# EAGLE design terminals (EAGLE 9.3.1)
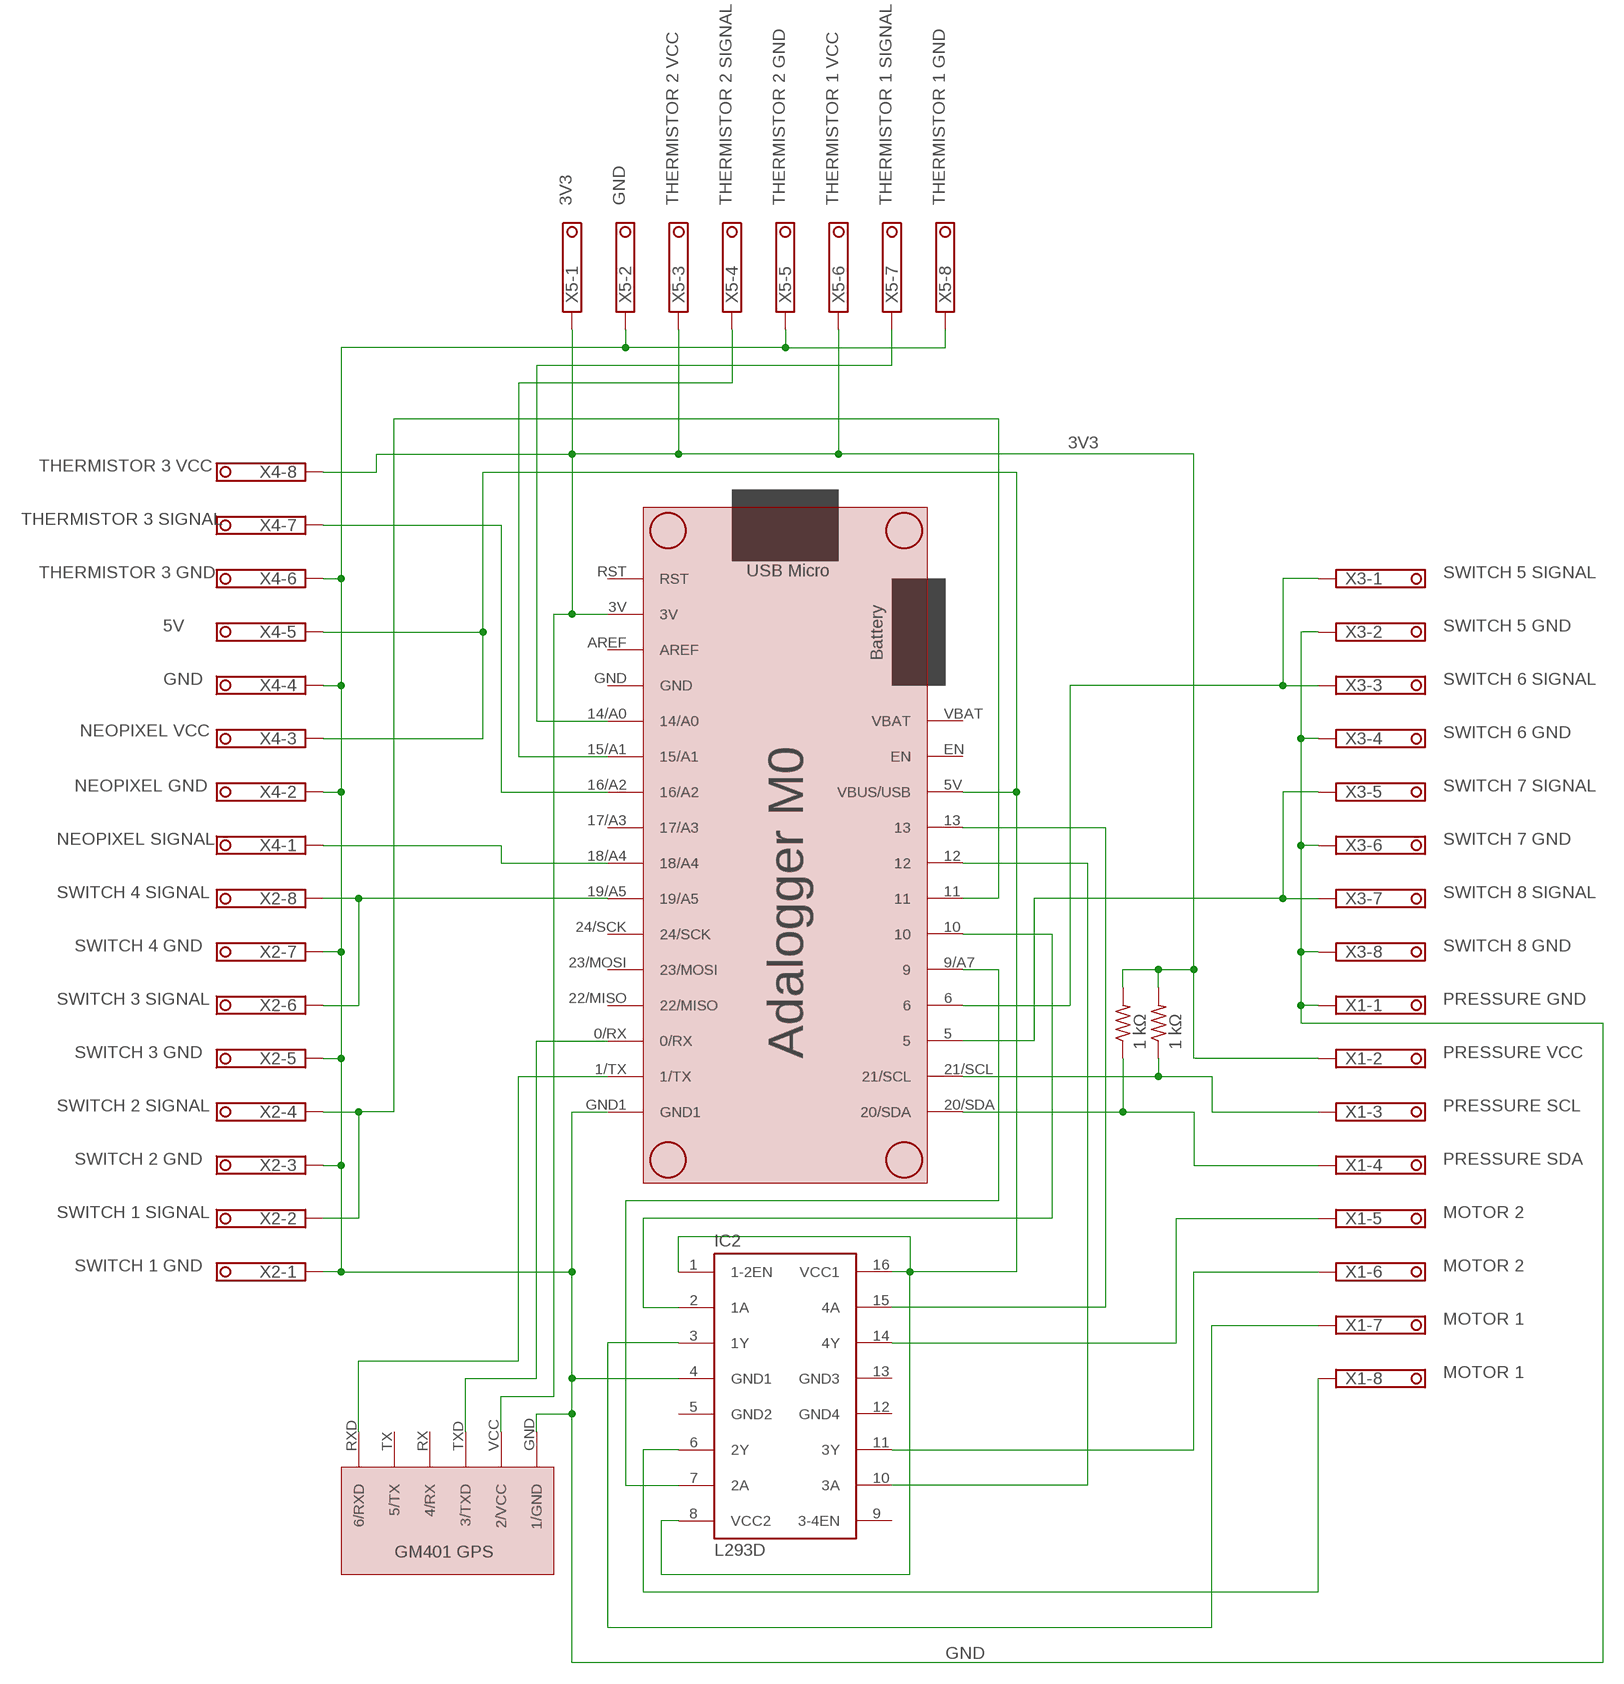
[diagram p0: schematic, sheet 1]

## Parts
IC2  L293D  [DIL16]
M0  Adalogger M0  ADALOGGER_M0  [BOARD]
R1  1 kΩ  R-US_0204/7  [0204/7]
R5  1 kΩ  R-US_0204/7  [0204/7]
U$1  GPS  [GPS_BREAKOUT]
X1  1751303  [1751303]
X2  1751303  [1751303]
X3  1751303  [1751303]
X4  1751303  [1751303]
X5  1751303  [1751303]

## Nets
3V3: M0.3V R1.2 R5.2 U$1.VCC(2/VCC) X1.2 X4.8 X5.1 X5.3 X5.6
5V: IC2.1(1-2EN) IC2.8(VCC2) IC2.16(VCC1) M0.5V(VBUS/USB) X4.3 X4.5
GND: IC2.4(GND1) M0.GND1 U$1.GND(1/GND) X1.1 X2.1 X2.3 X2.5 X2.7 X3.2 X3.4 X3.6 X3.8 X4.2 X4.4 X4.6 X5.2 X5.5 X5.8
GPS_RX: M0.1/TX U$1.RXD(6/RXD)
GPS_TX: M0.0/RX U$1.TXD(3/TXD)
L293_1A: IC2.2(1A) M0.10
L293_2A: IC2.7(2A) M0.9/A7
MOTOR_1_NEG: IC2.6(2Y) X1.8
MOTOR_1_POS: IC2.3(1Y) X1.7
MOTOR_2_NEG: IC2.11(3Y) X1.6
MOTOR_2_POS: IC2.14(4Y) X1.5
N$28: IC2.15(4A) M0.13
N$30: IC2.10(3A) M0.12
NEOPIXEL_SIG: M0.18/A4 X4.1
SCL: M0.21/SCL R5.1 X1.3
SDA: M0.20/SDA R1.1 X1.4
SW_1_2_SIG: M0.11 X2.2 X2.4
SW_3_4_SIG: M0.19/A5 X2.6 X2.8
SW_5_6_SIG: M0.6 X3.1 X3.3
SW_7_8_SIG: M0.5 X3.5 X3.7
THERM_1_SIG: M0.14/A0 X5.7
THERM_2_SIG: M0.15/A1 X5.4
THERM_3_SIG: M0.16/A2 X4.7
Unconnected: IC2.9(3-4EN) M0.17/A3 M0.22/MISO M0.23/MOSI M0.24/SCK M0.AREF M0.EN M0.GND M0.RST M0.VBAT U$1.RX(4/RX) U$1.TX(5/TX)

## Notes on the sheet
- 3V3 | GND | THERMISTOR 2 VCC | THERMISTOR 2 SIGNAL | THERMISTOR 2 GND | THERMISTOR 1 VCC | THERMISTOR 1 SIGNAL | THERMISTOR 1 GND
- 3V3
- THERMISTOR 3 VCC
- THERMISTOR 3 SIGNAL
- THERMISTOR 3 GND | SWITCH 5 SIGNAL
- 5V | SWITCH 5 GND
- GND | SWITCH 6 SIGNAL
- NEOPIXEL VCC | SWITCH 6 GND
- NEOPIXEL GND | SWITCH 7 SIGNAL
- NEOPIXEL SIGNAL | SWITCH 7 GND
- SWITCH 4 SIGNAL | SWITCH 8 SIGNAL
- SWITCH 4 GND | SWITCH 8 GND
- SWITCH 3 SIGNAL | PRESSURE GND
- SWITCH 3 GND | PRESSURE VCC
- SWITCH 2 SIGNAL | PRESSURE SCL
- SWITCH 2 GND | PRESSURE SDA
- SWITCH 1 SIGNAL | MOTOR 2
- SWITCH 1 GND | MOTOR 2
- MOTOR 1
- MOTOR 1
- GND

## Power pins joined to a net without a drawn wire
GND2: IC2.5(GND2)
GND3: IC2.13(GND3)
GND4: IC2.12(GND4)

## Library data of the parts
IC2 = st-microelectronics:L293D: PUSH-PULL 4 CHANNEL DRIVER; MPN: L293D; OC_FARNELL: 9589619; OC_NEWARK: 56P8249
M0 = Adalogger_32u4:ADALOGGER_M0
R1 R5 = adafruit:R-US_: RESISTOR, American symbol
U$1 = Adalogger_32u4:GPS
X1-X5 = con-phoenix-350:1751303: MKDS 1/ 8-3,5 Printklemme Nennstrom: 10 A Bemessungsspannung: 160 V Raster: 3,5 mm Polzahl: 8 Montageart: Löten Anschlussart: Schraubanschluss Anschlussrichtung vom Leiter zur Platine: 0° Source: http://eshop.phoenixcontact.com .. .pdf; OC_FARNELL: unknown; OC_NEWARK: unknown

## Board
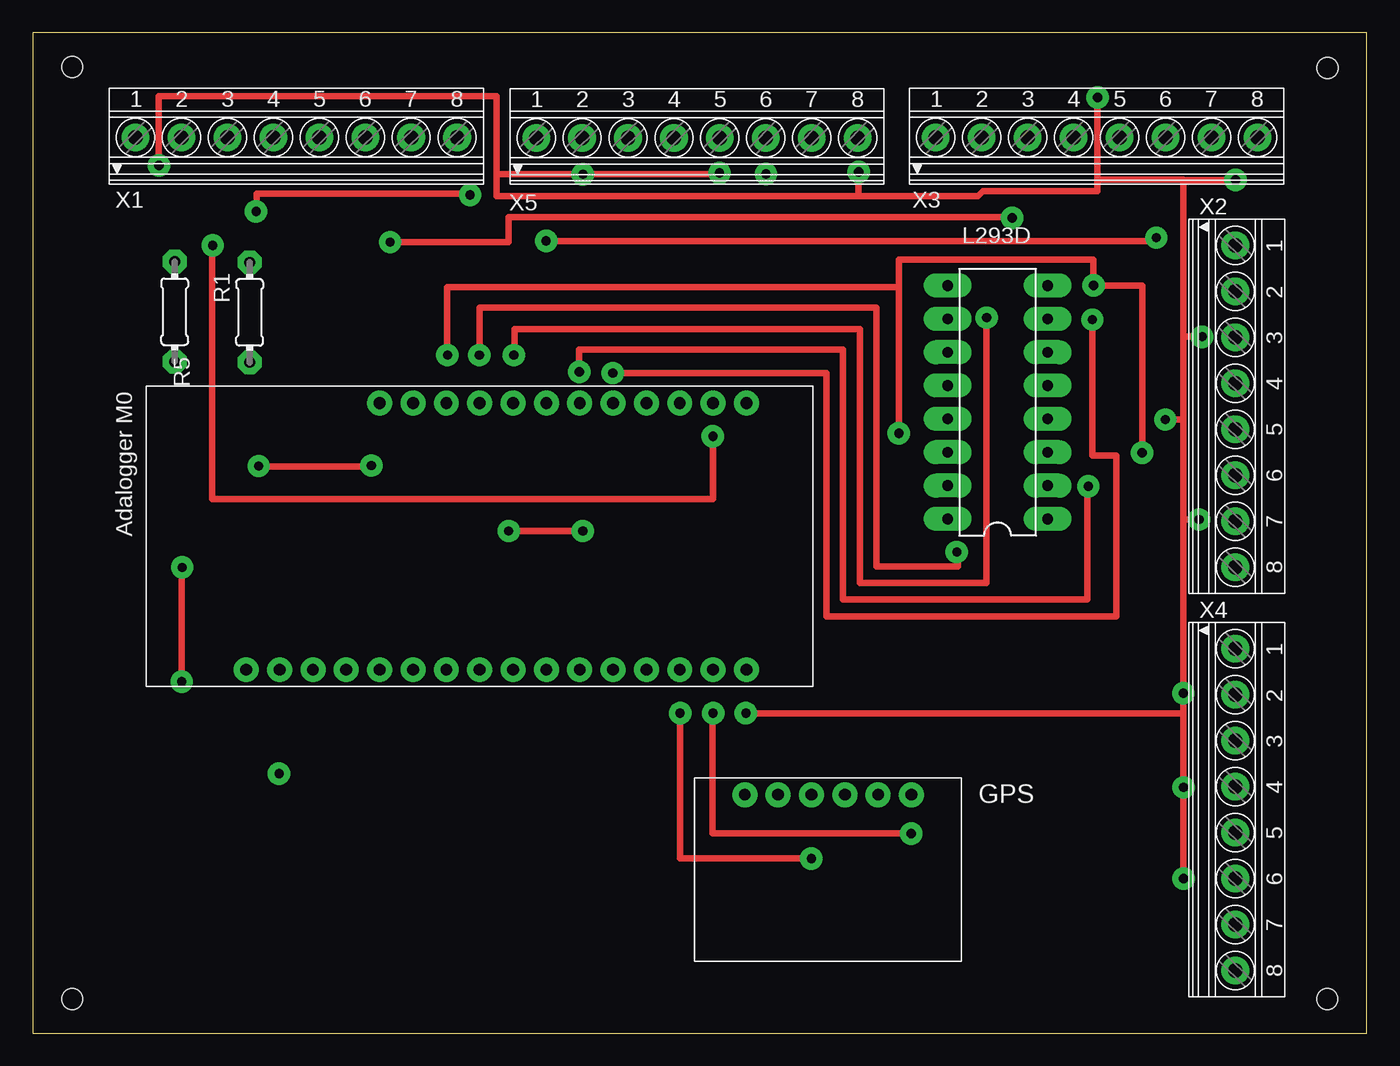
[diagram p1: board, top side]
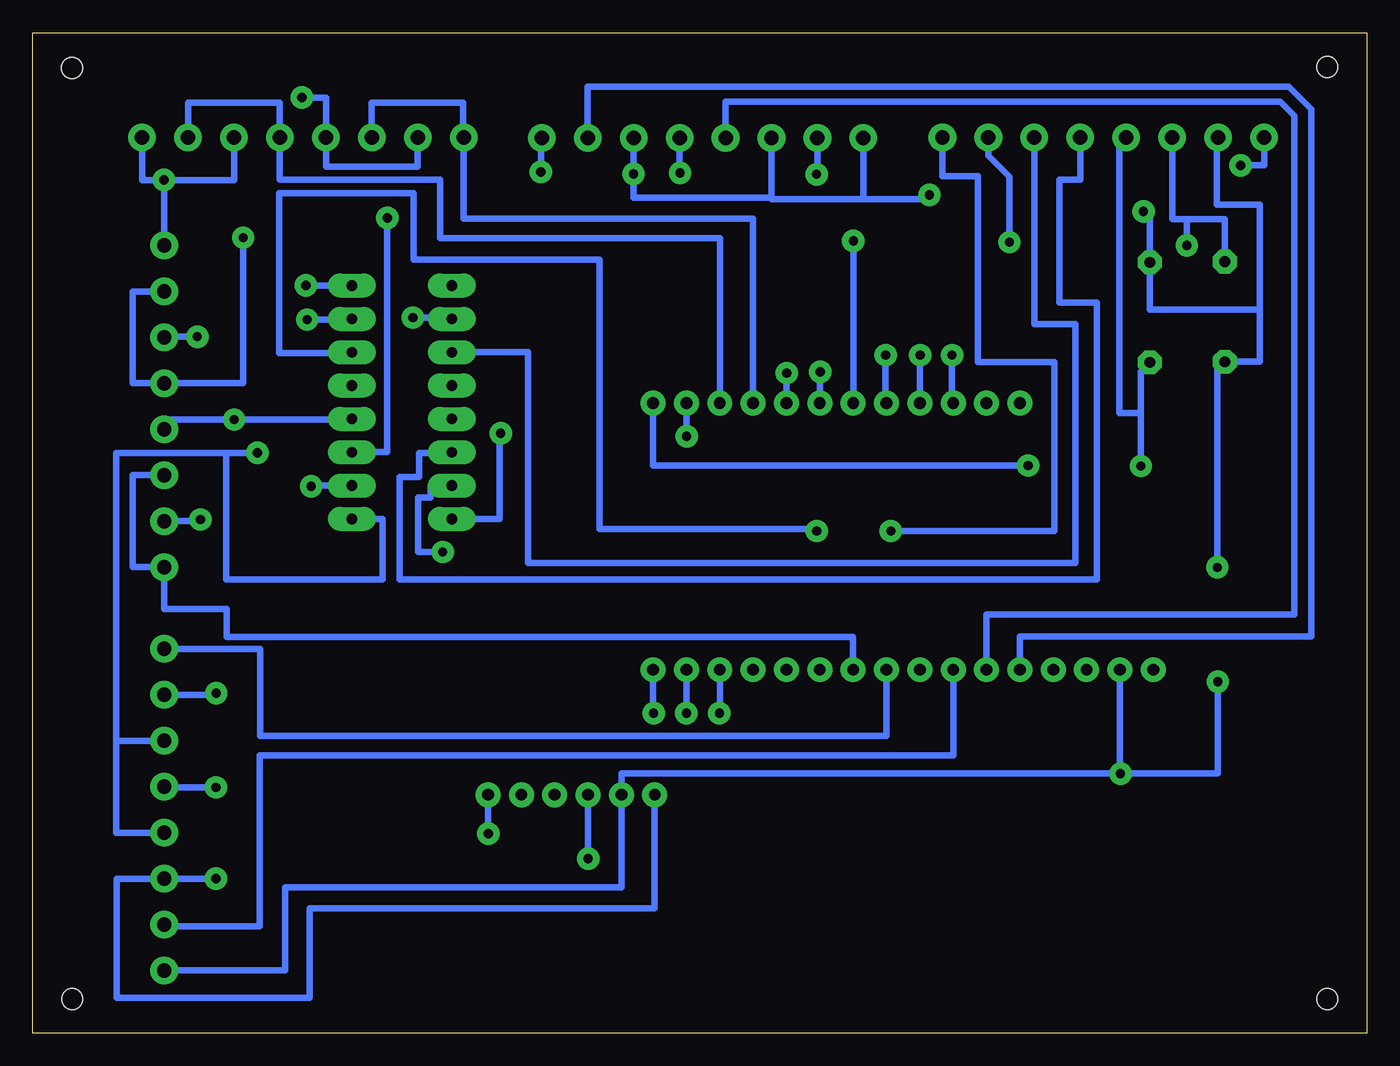
[diagram p2: board, bottom side, seen from below]

Size 101.6 x 76.2 mm. Coordinates in mm from the lower left corner, seen from the top.
Outline: 0,0 101.6,0 101.6,76.2 0,76.2 0,0
Copper layers (1*16): Top 0.035mm / dielectric 1.5mm / Bottom 0.035mm
Design rules "voltera-dru *": minimum track width 10mil, minimum drill 0.7mm, track to track 10mil, track to pad 10mil, pad to pad 0.6mm, via to via 0.6mm, smd to smd 0mil, copper to edge 0mil, drill to drill 0.8mm, minimum pad ring 0.5mm, minimum via ring 0.5mm, stop-mask expansion 4mil, vias tented up to drill 0mil, thermal gap 10mil
Holes 1.6 mm at 3,73.6 98.61,73.53 98.6,2.6 3,2.6

### Footprints (pad centres in the part's own frame; a part is rotated, then mirrored left to right if it is on the bottom)
DIL16 = drill 0.813 long: 1 -8.89,-3.81; 2 -6.35,-3.81; 3 -3.81,-3.81; 4 -1.27,-3.81; 5 1.27,-3.81; 6 3.81,-3.81; 7 6.35,-3.81; 8 8.89,-3.81; 9 8.89,3.81; 10 6.35,3.81; 11 3.81,3.81; 12 1.27,3.81; 13 -1.27,3.81; 14 -3.81,3.81; 15 -6.35,3.81; 16 -8.89,3.81
BOARD = drill 0.9 pad 1.7: 0/RX 1.27,-40.64; 1/TX 1.27,-43.18; 3V 1.27,-10.16; 5 21.59,-40.64; 5V 21.59,-22.86; 6 21.59,-38.1; 9/A7 21.59,-35.56; 10 21.59,-33.02; 11 21.59,-30.48; 12 21.59,-27.94; 13 21.59,-25.4; 14/A0 1.27,-17.78; 15/A1 1.27,-20.32; 16/A2 1.27,-22.86; 17/A3 1.27,-25.4; 18/A4 1.27,-27.94; 19/A5 1.27,-30.48; 20/SDA 21.59,-45.72; 21/SCL 21.59,-43.18; 22/MISO 1.27,-38.1; 23/MOSI 1.27,-35.56; 24/SCK 1.27,-33.02; AREF 1.27,-12.7; EN 21.59,-20.32; GND 1.27,-15.24; GND1 1.27,-45.72; RST 1.27,-7.62; VBAT 21.59,-17.78
0204/7 = drill 0.813 pad 1.676 octagon: 1 -3.81,0; 2 3.81,0
GPS_BREAKOUT = drill 0.9 pad 1.27: GND 3.81,-1.27; RX 11.43,-1.27; RXD 16.51,-1.27; TX 13.97,-1.27; TXD 8.89,-1.27; VCC 6.35,-1.27
1751303 = drill 1.1 pad 1.7: 1 -12.25,-0.1; 2 -8.75,-0.1; 3 -5.25,-0.1; 4 -1.75,-0.1; 5 1.75,-0.1; 6 5.25,-0.1; 7 8.75,-0.1; 8 12.25,-0.1

### Placement (x,y rotation side)
IC2  73.48,48.06 90 top
M0  8.64,26.42 90 top
R1  16.51,54.9 90 top
R5  10.8,54.95 270 top
U$1  50.42,19.43 0 top
X1  20.07,68.33 0 top
X2  91.69,47.75 270 top
X3  81.03,68.33 0 top
X4  91.69,17.02 270 top
X5  50.59,68.31 0 top

### Tracks (layer width: path | path; a pad name or v marks a point on that pad's centre or on a via)
3V3  (via drill 0.7)
  Top 0.5: v11.38,35.48 11.34,35.44 v11.34,26.77 | v17,62.6 17.03,62.63 17.03,63.93 33.23,63.93 v33.31,63.85
  Bottom 0.5: v18.75,19.77 18.8,19.81 M0.3V | v18.75,19.77 56.77,19.77 U$1.VCC 56.77,11.1 82.39,11.1 82.39,4.77 X4.8 | X5.6 v55.84,65.44 55.84,63.62 45.34,63.62 | 45.34,63.62 45.34,63.52 38.34,63.52 | 45.34,63.62 X5.3 | 38.34,63.52 X5.1 | 8.13,55.1 16.51,55.1 R1.2 16.51,62.6 v17,62.6 | v18.75,19.77 11.34,19.77 v11.34,26.77 | v11.38,35.48 11.38,51.14 R5.2 8.13,51.14 8.13,55.1 | 8.13,55.1 8.13,63.1 11.4,63.1 11.4,67.9 11.32,67.9 X1.2 | v33.31,63.85 33.31,63.52 38.34,63.52
5V  (via drill 0.7, 0.7 pad 0.9)
  Top 0.5: 65.99,56.83 31.57,56.83 31.57,51.65 v31.59,51.65 | 65.99,56.83 65.99,58.93 80.8,58.93 v80.8,56.95 84.5,56.95 v84.5,44.2 | 65.99,56.83 65.99,45.7 v65.96,45.7
  Bottom 0.5: IC2.16 66.06,39.17 66.06,45.7 v65.96,45.7 | 86.85,44.2 86.85,34.54 74.95,34.54 74.95,39.17 IC2.1 | 86.85,44.2 95.25,44.2 95.25,22.27 | 95.25,22.27 X4.3 | 95.25,22.27 95.25,15.24 91.59,15.24 X4.5 | v80.8,56.95 IC2.8 | v31.59,51.65 31.59,48.1 M0.5V | 86.85,44.2 v84.5,44.2
GND  (via drill 0.7)
  Top 0.5: 62.9,63.74 72,63.74 72.38,64.12 81.1,64.12 81.1,65.02 | 62.9,63.74 35.31,63.74 35.31,65.42 | 81.1,65.02 87.63,65.02 87.63,64.99 | 87.63,24.35 v87.63,25.89 87.63,39.13 | 87.63,39.13 87.63,46.75 | 35.31,65.42 35.31,71.37 9.62,71.37 9.6,71.36 v9.6,66.1 | 87.63,24.35 54.32,24.35 v54.31,24.37 | 87.63,46.75 87.63,53.05 | 87.63,53.05 87.63,64.99 | v91.61,64.99 87.63,64.99 | 87.63,46.75 86.26,46.75 v86.26,46.74 | 87.63,24.35 87.63,18.72 v87.65,18.72 v87.65,11.77 | 87.63,39.13 v88.83,39.13 v88.83,39.12 | 87.63,53.05 v89.07,53.05 | 81.1,65.02 v81.1,71.27 | 62.9,63.74 v62.9,65.6 | 35.31,65.42 v41.9,65.42 52.2,65.42 v52.3,65.52
  Bottom 0.5: IC2.4 77.29,46.74 v86.26,46.74 91.59,46.74 X2.5 | v54.31,24.37 54.36,24.41 M0.GND1 | U$1.GND 54.23,9.5 80.5,9.5 80.5,2.7 95.2,2.7 95.2,11.77 X4.6 v87.65,11.77 | v87.65,18.72 91.59,18.72 X4.4 | v87.63,25.89 87.63,25.77 X4.2 | v88.83,39.12 88.83,39 X2.7 | v89.07,53.05 v89.08,53.04 91.59,53.04 X2.3 | v91.61,64.99 91.61,60 X2.1 | v91.61,64.99 93.28,64.99 X3.8 | v91.61,64.99 86.28,64.99 X3.6 | v81.1,71.27 79.28,71.27 X3.4 79.28,66 72.28,66 X3.2 | v9.6,66.1 8.3,66.1 7.82,66.1 X1.1 | v62.9,65.6 62.9,68.21 X5.8 | v41.9,65.42 41.84,65.42 X5.2 | v52.3,65.52 52.34,65.52 X5.5
GPS_RX  (via drill 0.7)
  Top 0.5: v51.82,24.37 51.77,24.37 51.77,15.2 v66.9,15.2
  Bottom 0.5: v51.82,24.37 M0.1/TX | v66.9,15.2 66.93,15.2 U$1.RXD
GPS_TX  (via drill 0.7)
  Top 0.5: v59.3,13.3 49.3,13.3 v49.3,24.37
  Bottom 0.5: v49.3,24.37 49.28,24.39 M0.0/RX | v59.3,13.3 v59.31,13.3 U$1.TXD
L293_1A  (via drill 0.7)
  Top 0.5: v41.63,50.37 41.61,50.37 41.61,52.06 61.72,52.06 61.72,33.02 80.34,33.02 80.34,41.65 v80.39,41.65
  Bottom 0.5: v80.39,41.65 80.39,41.71 IC2.2 | v41.63,50.37 41.63,48.03 M0.10
L293_2A  (via drill 0.7)
  Top 0.5: v44.18,50.29 60.45,50.29 60.45,31.75 82.55,31.75 82.55,44 80.7,44 v80.7,54.35
  Bottom 0.5: v80.7,54.35 77.29,54.35 IC2.7 | v44.18,50.29 44.18,48.02 M0.9/A7
MOTOR_1_NEG  (via drill 0.7)
  Top 0.5: v41.89,38.25 v36.25,38.25
  Bottom 0.5: X1.8 32.32,65.27 29.63,65.27 29.63,51.1 23.8,51.1 23.8,38.24 36.25,38.24 v36.25,38.25 | IC2.6 77.29,51.82 82.83,51.82 82.83,56.9 | v41.89,38.25 42.02,38.39 58.42,38.39 58.42,58.93 72.6,58.93 72.6,64 82.83,64 82.83,56.9 | 82.83,56.9
MOTOR_1_POS  (via drill 0.7)
  Top 0.5: v27.22,60.25 36.25,60.25 36.25,62.15 74.6,62.15 v74.6,62.1
  Bottom 0.5: X1.7 28.82,66.83 27.22,65.23 v27.22,60.25 | v74.6,62.1 74.6,44.25 IC2.3
MOTOR_2_NEG
  Bottom 0.5: IC2.11 63.89,51.87 63.89,35.81 22.19,35.81 22.19,54.02 25.3,54.02 25.3,68.22 X1.6
MOTOR_2_POS
  Bottom 0.5: X1.5 21.82,65.01 23.41,65.01 23.41,55.65 20.54,55.65 20.54,34.54 73.66,34.54 73.66,42.35 72.18,42.35 72.18,44.2 69.67,44.2 IC2.14
N$28  (via drill 0.7)
  Top 0.5: v70.38,36.65 70.45,36.58 70.45,35.56 64.26,35.56 64.26,55.26 34.04,55.26 34.04,51.68 v34.01,51.65
  Bottom 0.5: v34.01,51.65 34.01,48.03 M0.13 | v70.38,36.65 72.26,36.65 72.26,40.8 71.3,40.8 71.3,41.71 IC2.15
N$30  (via drill 0.7)
  Top 0.5: v72.65,54.51 72.65,34.29 62.99,34.29 62.99,53.63 36.69,53.63 36.69,51.7 v36.64,51.65
  Bottom 0.5: v72.65,54.51 69.77,54.51 IC2.10 | v36.64,51.65 36.64,48.07 M0.12
NEOPIXEL_SIG
  Bottom 0.5: X4.1 84.27,29.27 84.27,22.64 36.58,22.64 M0.18/A4
SCL  (via drill 0.7)
  Top 0.5: v51.8,45.46 51.8,40.68 13.67,40.68 13.67,60 v13.7,60
  Bottom 0.5: v51.8,45.46 51.8,47.99 M0.21/SCL | R5.1 10.8,62 13.72,62 | X1.3 14.82,62 13.72,62 | v13.7,60 13.72,60 13.72,62
SDA  (via drill 0.7)
  Top 0.5: v25.79,43.23 25.79,43.16 17.2,43.16 v17.2,43.2
  Bottom 0.5: v25.79,43.23 54.36,43.23 M0.20/SDA | 17.2,47.23 17.2,50.41 R1.1 | 17.2,47.23 v17.2,43.2 | 17.2,47.23 18.82,47.23 18.82,67.72 X1.4
SW_1_2_SIG  (via drill 0.7)
  Top 0.5: v85.58,60.6 85.33,60.35 v39.1,60.35
  Bottom 0.5: X2.2 93.98,56.5 93.98,49.5 X2.4 85.58,49.5 v85.58,60.6 | v39.1,60.35 39.1,48.01 M0.11
SW_3_4_SIG
  Bottom 0.5: X2.6 93.98,42.5 93.98,35.5 X2.8 91.59,32.3 86.84,32.3 86.84,30.17 39.12,30.17 M0.19/A5
SW_5_6_SIG
  Bottom 0.5: X3.3 75.78,70.87 68.83,70.87 68.83,68.23 X3.1 68.78,62.06 46.74,62.06 M0.6
SW_7_8_SIG
  Bottom 0.5: X3.5 82.8,68.23 | 82.8,68.23 82.8,70.87 89.78,70.87 X3.7 | M0.5 49.28,60.54 70.58,60.54 70.58,65 72.3,65 82.8,65 82.8,68.23
THERM_1_SIG
  Bottom 0.5: X5.7 59.34,72.09 5.93,72.09 4.21,70.38 4.21,30.21 26.42,30.21 M0.14/A0
THERM_2_SIG
  Bottom 0.5: X5.4 48.84,70.96 6.58,70.96 5.52,69.9 5.52,31.88 28.96,31.88 M0.15/A1
THERM_3_SIG
  Bottom 0.5: X4.7 91.59,8.13 84.31,8.13 84.31,21.17 31.48,21.17 31.48,27.67 M0.16/A2

### Text on the board
tNames: Adalogger M0